# EAGLE design Short SBUS Hub (EAGLE 9.6.2)
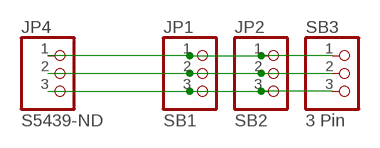
[diagram p0: schematic, sheet 1]

## Parts
JP1  SB1  PINHD-1X3  [1X03]
JP2  SB2  PINHD-1X3  [1X03]
JP4  S5439-ND  PINHD-1X3  [1X03]
SB3  3 Pin  PINHD-1X3  [1X03]

## Nets
N$1: JP1.3 JP2.3 JP4.3 SB3.3
N$2: JP1.2 JP2.2 JP4.2 SB3.2
N$3: JP1.1 JP2.1 JP4.1 SB3.1

## Library data of the parts
JP1 JP2 JP4 SB3 = pinhead:PINHD-1X3: PIN HEADER

## Board
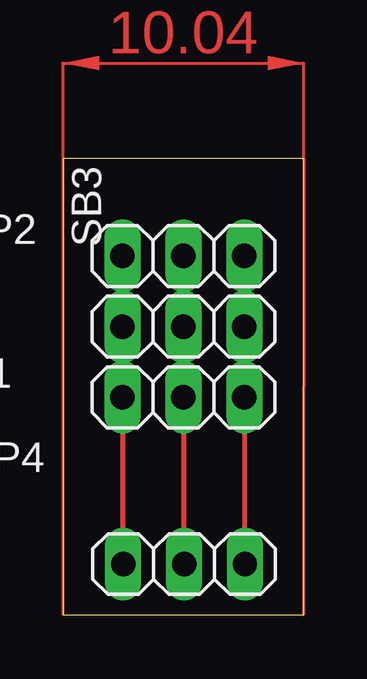
[diagram p1: board, top side]
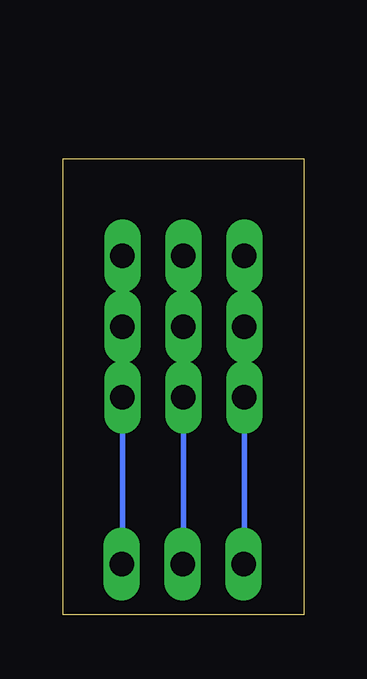
[diagram p2: board, bottom side, seen from below]

Size 10.04 x 19.01 mm. Coordinates in mm from the lower left corner, seen from the top.
Outline: 0,0 10.04,0 10.04,19.01 0,19.01 0,0
Copper layers (1*16): Top 0.035mm / dielectric 1.5mm / Bottom 0.035mm
Design rules "default": minimum track width 6mil, minimum drill 0.35mm, track to track 6mil, track to pad 6mil, pad to pad 6mil, via to via 6mil, smd to smd 6mil, copper to edge 40mil, drill to drill 6mil, minimum pad ring 10mil, minimum via ring 8mil, stop-mask expansion 4mil, vias tented up to drill 0mil, thermal gap 10mil

### Footprints (pad centres in the part's own frame; a part is rotated, then mirrored left to right if it is on the bottom)
1X03 = drill 1.016 long: 1 -2.54,0; 2 0,0; 3 2.54,0

### Placement (x,y rotation side)
JP1  5.02,9.06 0 top
JP2  5.02,12.01 0 top
JP4  5.05,2.11 0 top
SB3  5.02,14.96 0 top

### Tracks (layer width: path | path; a pad name or v marks a point on that pad's centre or on a via)
N$1
  Top 0.152: JP1.3 7.56,9 | 7.56,2.14 JP4.3
  Top 0.203: 7.56,9 7.56,2.14 | SB3.3 JP2.3 JP1.3
  Bottom 0.225: SB3.3 7.56,2.14 JP4.3
N$2
  Top 0.152: JP1.2 5.02,9 | 5.02,2.14 JP4.2
  Top 0.203: 5.02,9 5.02,2.14 | SB3.2 JP2.2 JP1.2
  Bottom 0.225: JP4.2 5.02,2.14 SB3.2
N$3
  Top 0.152: 2.48,2.14 JP4.1
  Top 0.203: 2.48,2.14 JP1.1 JP2.1 SB3.1
  Bottom 0.225: SB3.1 2.48,1.61 2,1.13
(copper drawn outside any net)
  shapes: Top area x2